# Altium schematic sheet Sheet3.SchDoc
size A4; SheetNumber: 4; SheetTotal: 5
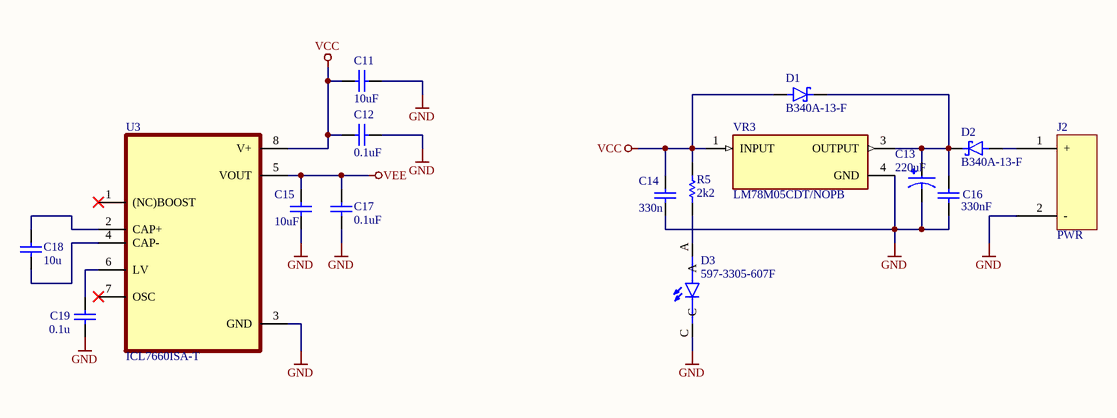
[diagram p0: Sheet3.SchDoc]

## Parts
C11  value 10uF  [CAPC2012X150N]  (hidden comment: Capacitor)
C12  value 0.1uF  [CAPC2012X150N]  (hidden comment: Capacitor)
C13  220uF  [CAP_EEEFT1V331AP]
C14  value 330n  [CAPC2012X150N]  (hidden comment: Capacitor)
C15  value 10uF  [CAPC2012X150N]  (hidden comment: Capacitor)
C16  value 330nF  [CAPC2012X150N]  (hidden comment: Capacitor)
C17  value 0.1uF  [CAPC2012X150N]  (hidden comment: Capacitor)
C18  value 10u  [CAPC2012X150N]  (hidden comment: Capacitor)
C19  value 0.1u  [CAPC2012X150N]  (hidden comment: Capacitor)
D1  B340A-13-F  [DIOM5226X240N]
D2  B340A-13-F  [DIOM5226X240N]
D3  597-3305-607F  [LEDC2012X70N]
J2  PWR  [JST_B2B-XH-A_(LF)(SN)]
R5  value 2k2  [RES_ERA6AHD330V]  (hidden comment: Resistor)
U3  ICL7660ISA-T  [SOIC127P600X175-8N]
VR3  LM78M05CDT/NOPB  [TO228P991X255-3N]

## Nets
GND: C11.2 C12.1 C13.2 C14.2 C15.1 C16.2 C17.1 C19.1 D3.C J2.2(-) U3.3(GND) VR3.4(GND)
VCC: C11.1 C12.2 C14.1 D1.A R5.2 U3.8(V+) VR3.1(INPUT)
VEE: C15.2 C17.2 U3.5(VOUT)
NetC13_1: C13.1 C16.1 D1.C D2.C VR3.3(OUTPUT)
NetC18_1: C18.1 U3.4(CAP-)
NetC18_2: C18.2 U3.2(CAP+)
NetC19_2: C19.2 U3.6(LV)
NetD2_A: D2.A J2.1(+)
NetD3_A: D3.A R5.1

Not connected (* = marked no-connect by the designer): U3 1((NC)BOOST)* 7(OSC)*

## Library data of the parts
C11 C12 C14-C19 = Capacitor: SimulationGenericComponent: True
C13 = EEEFT1V331AP: Capacitor,Alum Electrolytic,Cap 330 uF,Tol 20%,Vol-Rtg 35 VDC,SMT,8x10.2,TR | Panasonic Electronic Components EEE-FT1V331AP; SnapEDA_Link: https://www.snapeda.com/parts/EEE-FT1V331AP/Panasonic/view-part/?ref=snap; Package: RADIAL-2 Panasonic; Value: *; MF: Panasonic Electronic; MP: EEE-FT1V331AP; Check_prices: https://www.snapeda.com/parts/EEE-FT1V331AP/Panasonic/view-part/?ref=eda
D1 D2 = B340A-13-F: Schottky Diode 3A 40V 0.5Vf SMA | Diodes Inc B340A-13-F; MF: Diodes Inc.; SnapEDA_Link: https://www.snapeda.com/parts/B340A-13-F/Diodes+Inc./view-part/?ref=snap; Package: DO-214 Diodes Inc.; Value: *; MP: B340A-13-F; Check_prices: https://www.snapeda.com/parts/B340A-13-F/Diodes+Inc./view-part/?ref=eda
D3 = 597-3305-607F: LED Uni-Color Green 4-Pin Chip 0805 T/R; Availability: Unavailable; Value: *; Price: None; MP: 597-3305-607F; Package: None
J2 = Outp
R5 = Resistor: TC1: 0; SimulationGenericComponent: True; TC2: 0
U3 = ICL7660ISA-T: Switched-Capacitor Voltage Converters; MF: Analog Devices; MP: ICL7660ISA+; SnapEDA_Link: https://www.snapeda.com/parts/ICL7660ISA+/Analog+Devices/view-part/?ref=snap; Package: SOIC-8 Maxim; Value: *; Check_prices: https://www.snapeda.com/parts/ICL7660ISA+/Analog+Devices/view-part/?ref=eda
VR3 = LM78M05CDT/NOPB: 500-mA, 35-V, linear voltage regulator for 5 V; MF: Texas Instruments; SnapEDA_Link: https://www.snapeda.com/parts/LM78M05CDT/NOPB/Texas+Instruments/view-part/?ref=snap; Package: TO-252-3 Texas Instruments; Value: *; MP: LM78M05CDT/NOPB; Check_prices: https://www.snapeda.com/parts/LM78M05CDT/NOPB/Texas+Instruments/view-part/?ref=eda